# Altium schematic sheet Sch_Dr_PWR5V .SchDoc
size A4; Author: Noname; Organization: SpecGroup; Address3: ULY; Revision: Ver.1.0
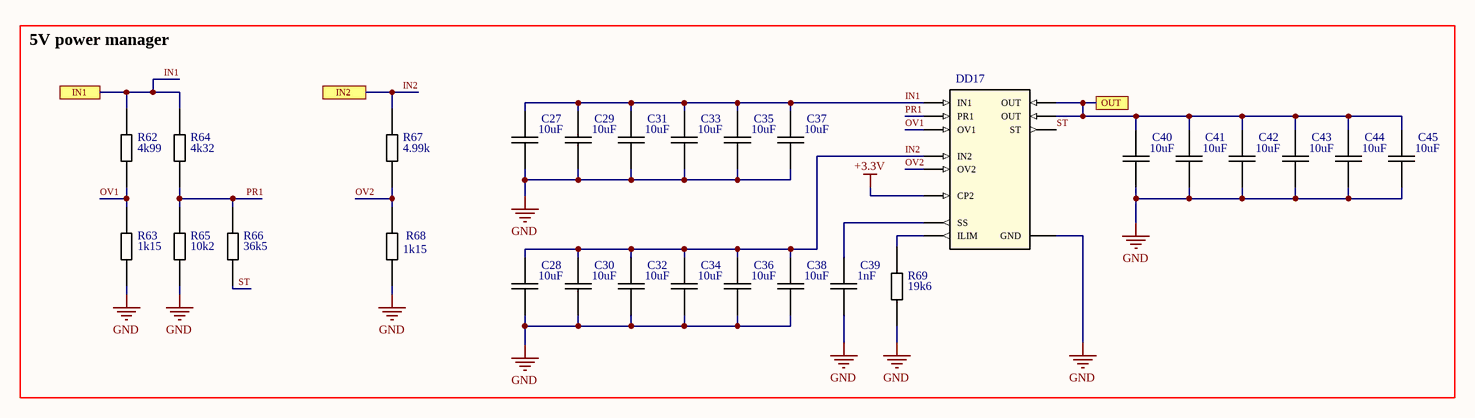
[diagram p0: Sch_Dr_PWR5V .SchDoc]

## Parts
C27  10uF  [Cap_0603]
C28  10uF  [Cap_0603]
C29  10uF  [Cap_0603]
C30  10uF  [Cap_0603]
C31  10uF  [Cap_0603]
C32  10uF  [Cap_0603]
C33  10uF  [Cap_0603]
C34  10uF  [Cap_0603]
C35  10uF  [Cap_0603]
C36  10uF  [Cap_0603]
C37  10uF  [Cap_0603]
C38  10uF  [Cap_0603]
C39  1nF  [Cap_0603]
C40  10uF  [Cap_0603]
C41  10uF  [Cap_0603]
C42  10uF  [Cap_0603]
C43  10uF  [Cap_0603]
C44  10uF  [Cap_0603]
C45  10uF  [Cap_0603]
DD17  TPS2121RUXR  [12-pin VQFN-HR]  (value not drawn)
R62  4k99  [Res_0603]
R63  1k15  [Res_0603]
R64  4k32  [Res_0603]
R65  10k2  [Res_0603]
R66  36k5  [Res_0603]
R67  4.99k  [Res_0603]
R68  1k15  [Res_0603]
R69  19k6  [Res_0603]

## Blocks framed on the sheet
5V power manager: C27-C45 DD17 R62-R69

## Ports
IN1, IN2, OUT

## Nets
+3.3V: DD17.3(CP2)
GND: C27.1 C28.1 C29.1 C30.1 C31.1 C32.1 C33.1 C34.1 C35.1 C36.1 C37.1 C38.1 C39.1 C40.1 C41.1 C42.1 C43.1 C44.1 C45.1 DD17.12(GND) R63.2 R65.2 R68.2 R69.2
IN1: C27.2 C29.2 C31.2 C33.2 C35.2 C37.2 DD17.7(IN1) R62.1 R64.1 ; port IN1
IN2: C28.2 C30.2 C32.2 C34.2 C36.2 C38.2 DD17.2(IN2) R67.1 ; port IN2
OUT: C40.2 C41.2 C42.2 C43.2 C44.2 C45.2 DD17.1(OUT) DD17.8(OUT) ; port OUT
OV1: DD17.5(OV1) R62.2 R63.1
OV2: DD17.4(OV2) R67.2 R68.1
PR1: DD17.6(PR1) R64.2 R65.1 R66.1
ST: DD17.9(ST) R66.2
NetC39_2: C39.2 DD17.11(SS)
NetDD17_10: DD17.10(ILIM) R69.1

## Notes on the sheet
- Title
- Size:
- Date:
- A4
- Number:
- Time:
- Revision:
- Sheet
- of
- File:

## Library data of the parts
C27-C38 C40-C45 = Cap_: CC0603KRX5R7BB106
C39 = Cap_: CC0603JRX7R9BB102
DD17 = TPS2121RUXR: 2.8V to 22V Priority Power MUX with Seamless Switchover
R62 R67 = Res_: RC0603FR-074K99L
R63 R68 = Res_: RC0603FR-071K15L
R64 = Res_: RC0603FR-074K32L
R65 = Res_: RC0603FR-0710K2L
R66 = Res_: RC0603FR-0736K5L
R69 = Res_: RC0603FR-0719K6L